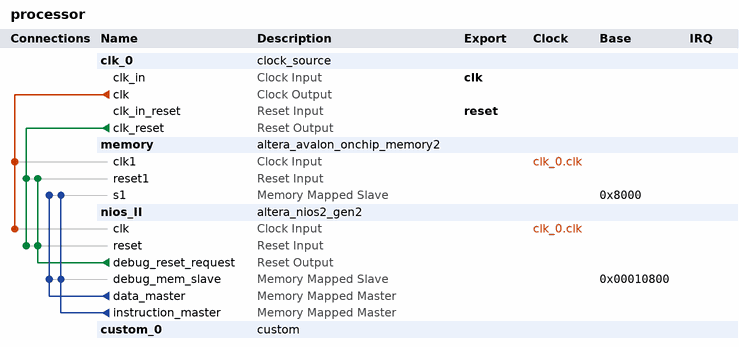
[diagram p0: system contents]
# Platform Designer (Qsys) system processor, Cyclone IV E EP4CE10E22A7
# Parameters at their usual value, and those the tool derives, are not listed.
package require -exact qsys 18.1
create_system processor
set_project_property DEVICE_FAMILY {Cyclone IV E}
set_project_property DEVICE EP4CE10E22A7

add_instance clk_0 clock_source 18.1
set_instance_parameter_value clk_0 clockFrequency 50000000

add_instance memory altera_avalon_onchip_memory2 18.1
set_instance_parameter_value memory dataWidth 32
set_instance_parameter_value memory dualPort false
set_instance_parameter_value memory initMemContent true
set_instance_parameter_value memory initializationFileName onchip_mem.hex
set_instance_parameter_value memory memorySize 20480

add_instance nios_II altera_nios2_gen2 18.1
set_instance_parameter_value nios_II dcache_size 2048
set_instance_parameter_value nios_II exceptionSlave memory.s1
set_instance_parameter_value nios_II icache_size 4096
set_instance_parameter_value nios_II impl Tiny
set_instance_parameter_value nios_II resetSlave memory.s1

add_instance custom_0 custom 1.0

# connections
add_connection clk_0.clk memory.clk1 clock
add_connection clk_0.clk nios_II.clk clock
add_connection clk_0.clk_reset memory.reset1 reset
add_connection clk_0.clk_reset nios_II.reset reset
add_connection nios_II.debug_reset_request memory.reset1 reset
add_connection nios_II.debug_reset_request nios_II.reset reset
add_connection nios_II.data_master memory.s1 avalon
set_connection_parameter_value nios_II.data_master/memory.s1 baseAddress 0x8000
add_connection nios_II.data_master nios_II.debug_mem_slave avalon
set_connection_parameter_value nios_II.data_master/nios_II.debug_mem_slave baseAddress 0x00010800
add_connection nios_II.instruction_master memory.s1 avalon
set_connection_parameter_value nios_II.instruction_master/memory.s1 baseAddress 0x8000
add_connection nios_II.instruction_master nios_II.debug_mem_slave avalon
set_connection_parameter_value nios_II.instruction_master/nios_II.debug_mem_slave baseAddress 0x00010800

# exported interfaces
add_interface clk clock sink
set_interface_property clk EXPORT_OF clk_0.clk_in
add_interface reset reset sink
set_interface_property reset EXPORT_OF clk_0.clk_in_reset

set_interconnect_requirement {$system} qsys_mm.clockCrossingAdapter HANDSHAKE
set_interconnect_requirement {$system} qsys_mm.enableEccProtection FALSE
set_interconnect_requirement {$system} qsys_mm.insertDefaultSlave FALSE
set_interconnect_requirement {$system} qsys_mm.maxAdditionalLatency 1

save_system processor.qsys
